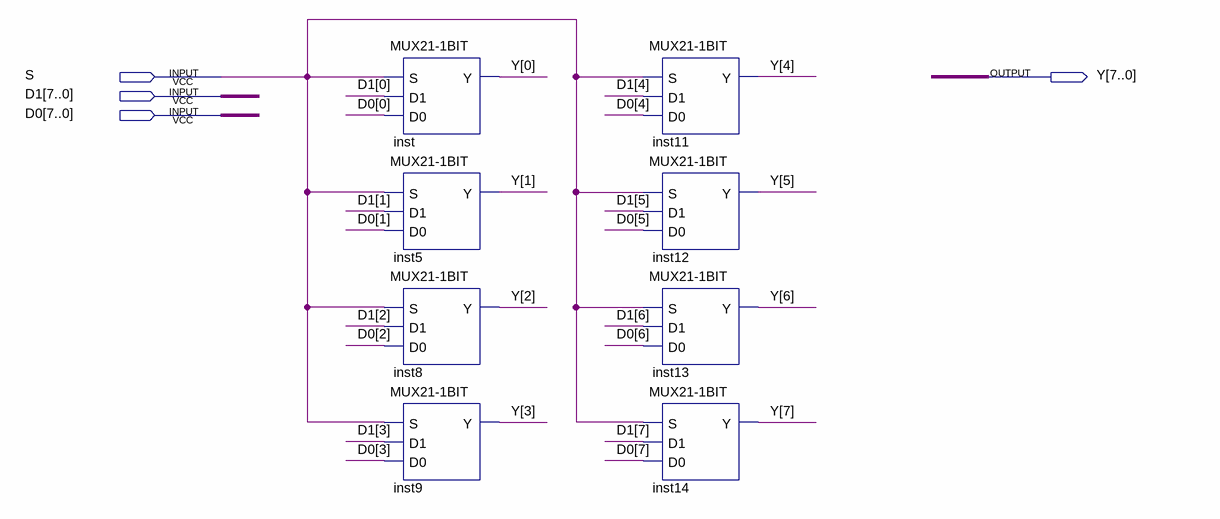
[diagram p0: schematic sheet]
// Quartus schematic MUX21-8BIT.bdf as structural Verilog: 8 symbols, 4 pins
module \MUX21-8BIT  (
  input  S,
  input  [7:0] D1,
  input  [7:0] D0,
  output [7:0] Y
);

  \MUX21-1BIT  inst (.S(S), .D1(D1[0]), .D0(D0[0]), .Y(Y[0]));
  \MUX21-1BIT  inst5 (.S(S), .D1(D1[1]), .D0(D0[1]), .Y(Y[1]));
  \MUX21-1BIT  inst8 (.S(S), .D1(D1[2]), .D0(D0[2]), .Y(Y[2]));
  \MUX21-1BIT  inst9 (.S(S), .D1(D1[3]), .D0(D0[3]), .Y(Y[3]));
  \MUX21-1BIT  inst11 (.S(S), .D1(D1[4]), .D0(D0[4]), .Y(Y[4]));
  \MUX21-1BIT  inst12 (.S(S), .D1(D1[5]), .D0(D0[5]), .Y(Y[5]));
  \MUX21-1BIT  inst13 (.S(S), .D1(D1[6]), .D0(D0[6]), .Y(Y[6]));
  \MUX21-1BIT  inst14 (.S(S), .D1(D1[7]), .D0(D0[7]), .Y(Y[7]));
endmodule
